# Altium project RS485_GPIO.PrjPcb (part 2 of 2)
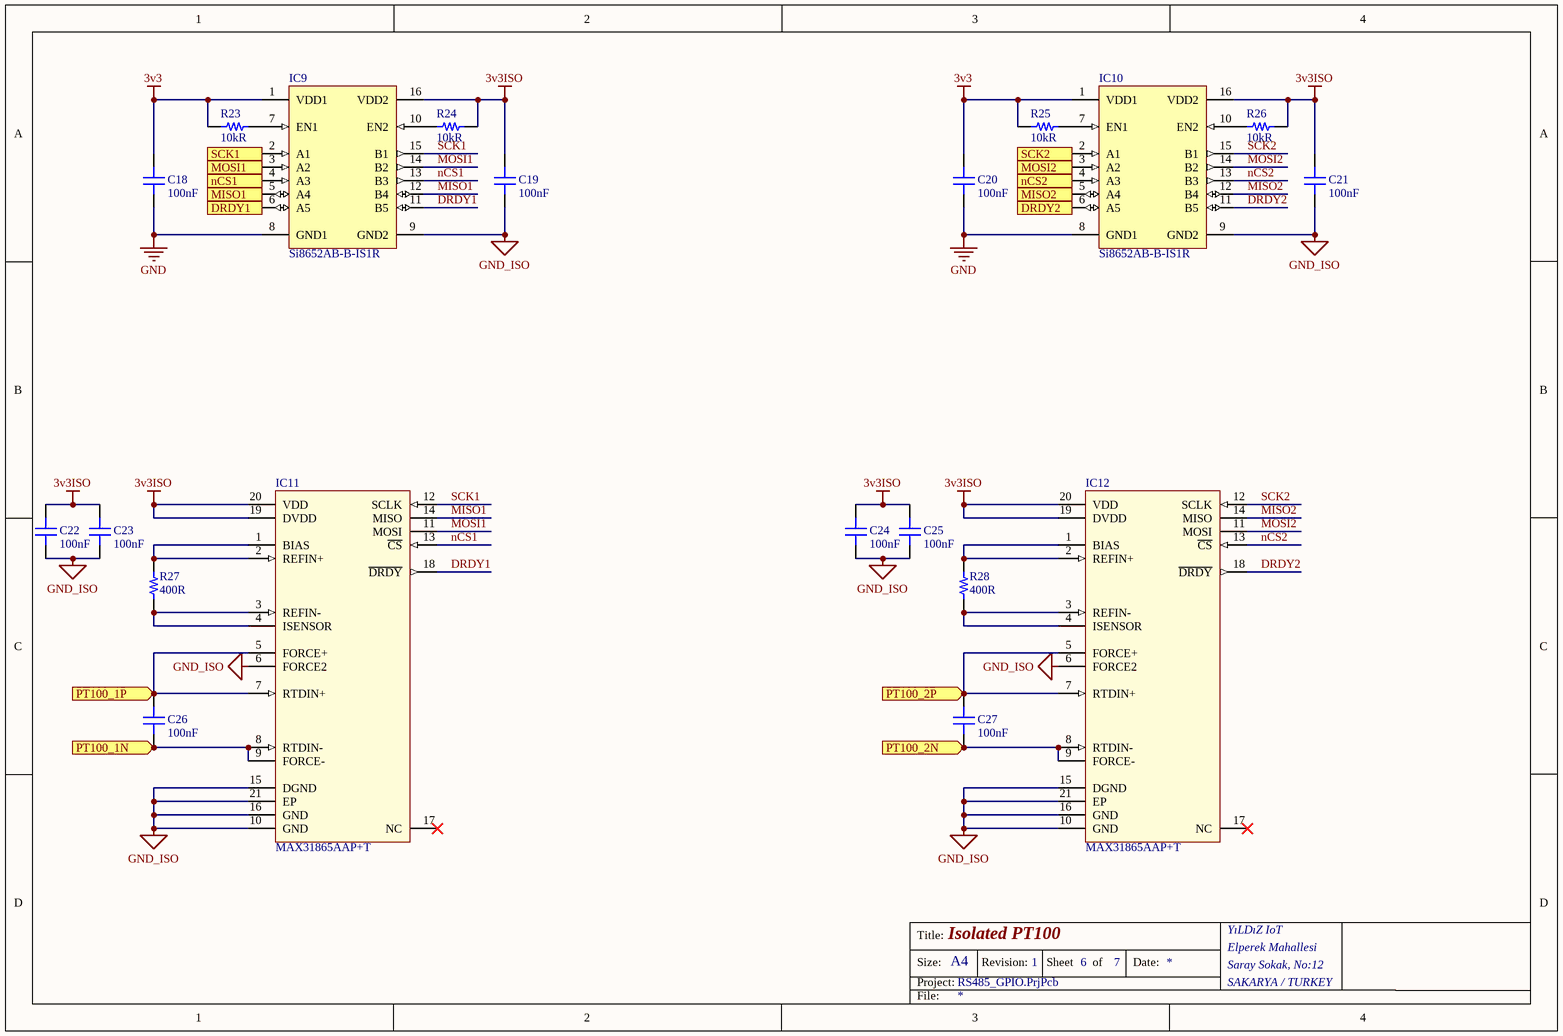
[diagram p4: PT100.SchDoc]

## Nets that join several sheets
3v3: Inputs (R7.2 R8.2), 4-20mA (C2.2 IC2.1 R2.1 R3.1), PT100 (6 pins)
3v3ISO: 4-20mA (8 pins), PT100 (14 pins)
24V: Inputs (F1.2 F2.2 F3.2 F4.2), Outputs (6 pins)
GND: Inputs (IC3.3 IC4.3 R11.2 R12.2), Outputs (C8.1 C9.1 IC5.2 IC6.2), 4-20mA (C2.1 IC2.4), PT100 (C18.1 C20.1 IC9.8 IC10.8)
GND_ISO: Inputs (6 pins), Outputs (Q1.2 Q2.2 R19.2 R20.2), 4-20mA (9 pins), PT100 (18 pins)
4-20mA_1: Inputs (R11.1 SW1.3), 4-20mA (R1.1)
4-20mA_2: Inputs (R12.1 SW2.3), 4-20mA (R6.1)
PT100_1N: Inputs (SW1.1), PT100 (C26.1 IC11.8 IC11.9)
PT100_1P: Inputs (SW1.4), PT100 (C26.2 IC11.5 IC11.7)
PT100_2N: Inputs (SW2.1), PT100 (C27.1 IC12.8 IC12.9)
PT100_2P: Inputs (SW2.4), PT100 (C27.2 IC12.5 IC12.7)